# Altium schematic sheet KT603DEMO.SchDoc
size A4
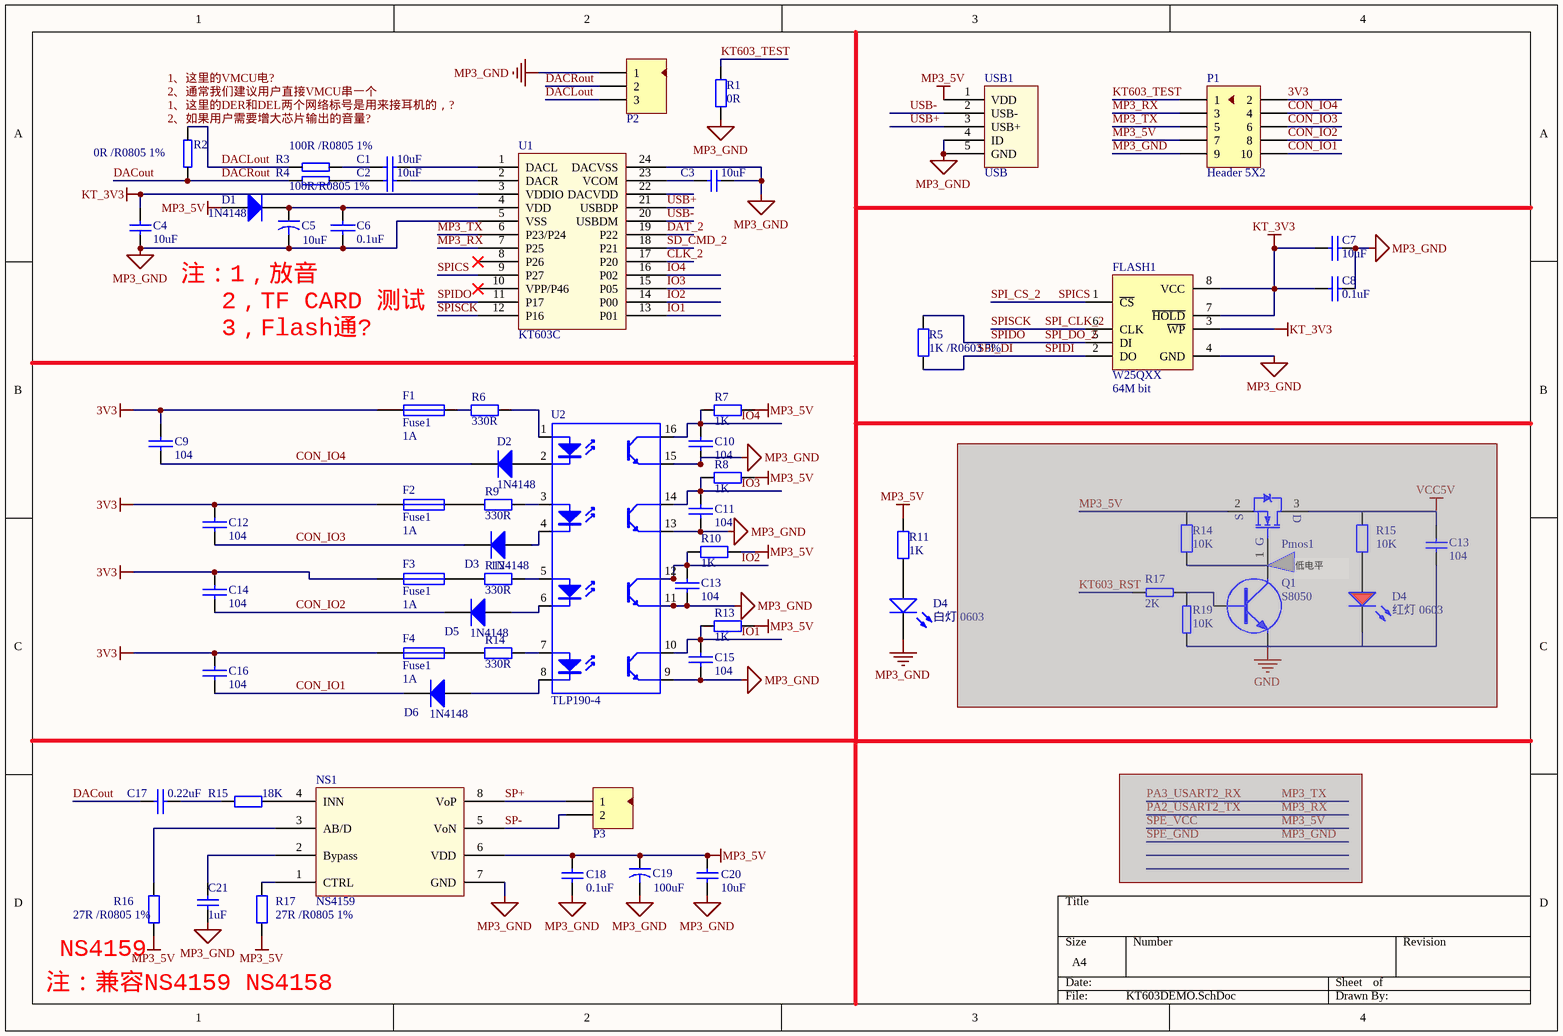
[diagram p0: KT603DEMO.SchDoc]

## Parts
(Parts that share a designator on the sheet are numbered #1, #2 ... from top to bottom, then left to right.)
C1  10uF  [LC-0603_C]
C2  10uF  [LC-0603_C]
C3  10uF  [LC-0805_C]
C4  10uF  [LC-0603_C]
C5  10uF  [LC-0603_C]
C6  0.1uF  [LC-0603_C]
C7  10uF  [LC-0603_C]
C8  0.1uF  [LC-0603_C]
C9  104  [LC-0603_C]
C10  104  [LC-0603_C]
C11  104  [LC-0603_C]
C12  104  [LC-0603_C]
C13#1  104  [LC-0603_C]  (masked out: inside a compile mask, not in the netlist)
C13#2  104  [LC-0603_C]
C14  104  [LC-0603_C]
C15  104  [LC-0603_C]
C16  104  [LC-0603_C]
C17  0.22uF  [LC-0805_C]
C18  0.1uF  [LC-0603_C]
C19  value 100uF  [CAP-3528]  (hidden comment: 220uF/16V)
C20  10uF  [LC-0805_C]
C21  1uF  [LC-0603_C]
D1  1N4148  [1N4148]
D2  1N4148  [LC-SOD-323]
D3  1N4148  [LC-SOD-323]
D4#1  红灯 0603  [LC-0603_LED_S1]  (masked out: inside a compile mask, not in the netlist)
D4#2  白灯 0603  [LC-0603_LED_S1]
D5  1N4148  [LC-SOD-323]
D6  1N4148  [LC-SOD-323]
F1  Fuse1  value 1A  [0805-1]
F2  Fuse1  value 1A  [0805-1]
F3  Fuse1  value 1A  [0805-1]
F4  Fuse1  value 1A  [0805-1]
FLASH1  W25QXX  Memory: 64M bit  [SOIC-8W]
NS1  NS4159  [SOIC8]
P1  Header 5X2  [HDR5X2-2.54]
P2  Header 3  [HDR3X1-2.54]  (value not drawn)
P3  Header 2  [KF2.54-2P]  (value not drawn)
Pmos1  SI2301  [LC-SOT-23(SOT-23-3)]  (value not drawn)  (masked out: inside a compile mask, not in the netlist)
Q1  S8050  [LC-SOT-23(SOT-23-3)]  (masked out: inside a compile mask, not in the netlist)
R1  0R  [R0603]
R2  0R /R0805 1%  [LC-0603_R]
R3  100R /R0805 1%  [LC-0603_R]
R4  100R/R0805 1%  [LC-0603_R]
R5  1K /R0603 5%  [0603-1]
R6  330R  [R0603]
R7  1K  [R0603]
R8  1K  [R0603]
R9  330R  [R0603]
R10  1K  [R0603]
R11  1K  [0603-1]
R12  330R  [R0603]
R13  1K  [R0603]
R14#1  10K  [LC-0603_R]  (masked out: inside a compile mask, not in the netlist)
R14#2  330R  [R0603]
R15#1  10K  [LC-0603_R]  (masked out: inside a compile mask, not in the netlist)
R15#2  18K  [LC-0603_R]
R16  27R /R0805 1%  [LC-0603_R]
R17#1  2K  [LC-0603_R]  (masked out: inside a compile mask, not in the netlist)
R17#2  27R /R0805 1%  [LC-0603_R]
R19  10K  [LC-0603_R]  (masked out: inside a compile mask, not in the netlist)
U1  KT603C  [SSOP24]
U2  TLP190-4  [SO16]
USB1  USB  [USB-MK5]

## Nets
3V3: C9.2 C12.2 C14.2 C16.2 F1.1 F2.1 F3.1 F4.1 P1.2
KT_3V3: C4.2 C7.1 C8.1 FLASH1.3(~{WP}) FLASH1.7(~{HOLD}) FLASH1.8(VCC) U1.3(VDDIO)
MP3_5V: C18.1 C19.1 C20.1 D1.1(A) NS1.6(VDD) P1.7 R7.1 R8.1 R10.1 R11.2 R13.1 R16.2 R17#2.2 USB1.1(VDD)
MP3_GND: C3.2 C4.1 C5.2 C6.1 C7.2 C8.2 C10.1 C11.1 C13#2.1 C15.1 C18.2 C19.2 C20.2 C21.2 D4#2.K FLASH1.4(GND) NS1.7(GND) P1.9 P2.1 R1.2 U1.5(VSS) U1.24(DACVSS) U2.9(E) U2.11(E) U2.13(E) U2.15(E) USB1.4(ID) USB1.5(GND)
CLK_2: U1.17(P20)
CON_IO1: C16.1 D6.2(K) P1.10
CON_IO2: C14.1 D5.2(K) P1.8
CON_IO3: C12.1 D3.2(K) P1.6
CON_IO4: C9.1 D2.2(K) P1.4
DACLout: P2.3 R2.1 R3.2
DACout: C17.1 P2.2 R2.2 R4.2  [also labelled DACRout]
DAT_2: U1.19(P22)
IO1: C15.2 R13.2 U1.13(P01) U2.10(C)
IO2: C13#2.2 R10.2 U1.14(P00) U2.12(C)
IO3: C11.2 R8.2 U1.15(P05) U2.14(C)
IO4: C10.2 R7.2 U1.16(P02) U2.16(C)
KT603_TEST: P1.1 R1.1
MP3_RX: P1.3 U1.7(P25)
MP3_TX: P1.5 U1.6(P23/P24)
SD_CMD_2: U1.18(P21)
SP+: NS1.8(VoP) P3.1
SP-: NS1.5(VoN) P3.2
SPI_CLK_2: FLASH1.6(CLK) U1.12(P16)  [also labelled SPISCK]
SPI_CS_2: FLASH1.1(~{CS}) U1.9(P27)  [also labelled SPICS]
SPI_DI: FLASH1.2(DO) R5.1  [also labelled SPIDI]
SPI_DO_2: FLASH1.5(DI) R5.2 U1.11(P17)  [also labelled SPIDO]
USB+: U1.21(USBDP) USB1.3(USB+)
USB-: U1.20(USBDM) USB1.2(USB-)
NetC1_1: C1.1 R3.1
NetC1_2: C1.2 U1.1(DACL)
NetC2_1: C2.1 R4.1
NetC2_2: C2.2 U1.2(DACR)
NetC3_1: C3.1 U1.23(VCOM)
NetC5_1: C5.1 C6.2 D1.2(K) U1.4(VDD)
NetC17_2: C17.2 R15#2.2
NetC21_1: C21.1 NS1.2(Bypass)
NetD2_1: D2.1(A) U2.2(K)
NetD3_1: D3.1(A) U2.4(K)
NetD4#2_A: D4#2.A R11.1
NetD5_1: D5.1(A) U2.6(K)
NetD6_1: D6.1(A) U2.8(K)
NetF1_2: F1.2 R6.2
NetF2_2: F2.2 R9.2
NetF3_2: F3.2 R12.2
NetF4_2: F4.2 R14#2.2
NetNS1_1: NS1.1(CTRL) R17#2.1
NetNS1_3: NS1.3(AB/D) R16.1
NetNS1_4: NS1.4(INN) R15#2.1
NetR6_1: R6.1 U2.1(A)
NetR9_1: R9.1 U2.3(A)
NetR12_1: R12.1 U2.5(A)
NetR14#2_1: R14#2.1 U2.7(A)

Not connected (* = marked no-connect by the designer): U1 8(P26)* 10(VPP/P46)* 22(DACVDD)

## Notes on the sheet
- 注：1，放音
- 2，TF CARD 测试
- 3，Flash通?
- 低电平
- (near R16) NS4159
- 注：兼容NS4159 NS4158
- Labels drawn without touching a wire or pin: 1、这里的DER和DEL两个网络标号是用来接耳机的，?, 1、这里的VMCU电?, 2、如果用户需要增大芯片输出的音量?, 2、通常我们建议用户直接VMCU串一个

## Library data of the parts
C1 C2 C4 C13#1 C18 C20 C21 = Cap: Capacitor; Published: 8-Jun-2000; Publisher: Altium Limited
  C1 C2 C4 C20: Revision: July-2002: Re-released for DXP Platform.; Value: 10uF
  C13#1: LatestRevisionDate: 17-Jul-2002; LatestRevisionNote: Re-released for DXP Platform.; PackageReference: RAD-0.3; Value: 104
  C18: Revision: July-2002: Re-released for DXP Platform.; Value: 0.1uF
  C21: Revision: July-2002: Re-released for DXP Platform.; Value: 1uF
C3 = Cap: Capacitor; Value: 1uF; Published: 8-Jun-2000; Revision: July-2002: Re-released for DXP Platform.; Publisher: Altium Limited
C5 C19 = Cap2: Capacitor; Published: 23-Sep-2002; PackageReference: CAPR5-4X5; Publisher: Altium Limited
  C5: Value: 10uF
C6-C12 C13#2 C14-C17 = C
D1-D3 D5 D6 = Diode: Default Diode; Published: 8-Jun-2000; LatestRevisionDate: 17-Jul-2002; LatestRevisionNote: Re-released for DXP Platform.; PackageDocument: Sep-1996; PackageReference: SMC; Publisher: Altium Limited; Code_JEDEC: DO-214-AB
D4#1 = 0603 红灯: 发光二极管; ComponentLink1Description: 供应商链接; ComponentLink1URL: http://www.szlcsc.com/product/details_2659.html; Package: 0603; Supplier: LC; SuppliersPartNumber: C2286
D4#2 = 0603 白灯: 发光二极管; ComponentLink1Description: 供应商链接; ComponentLink1URL: http://www.szlcsc.com/product/details_2663.html; Package: 0603; Supplier: LC; SuppliersPartNumber: C2290
F1-F4 = Fuse1: 保险丝
FLASH1 = W25QXX: SPI FLASH
P1 = Header 5X2: 接插件; LatestRevisionDate: 17-Jul-2002; LatestRevisionNote: Re-released for DXP Platform.; Publisher: Altium Limited
P2 = Header 3: 接插件; LatestRevisionDate: 17-Jul-2002; LatestRevisionNote: Re-released for DXP Platform.; Publisher: Altium Limited
P3 = Header: 接插件; LatestRevisionDate: 17-Jul-2002; LatestRevisionNote: Re-released for DXP Platform.; Publisher: Altium Limited
Pmos1 = N-MO
Q1 = NPN
R1 R6-R10 R12 R13 R14#2 = Res2: Resistor; Value: 82R; Published: 8-Jun-2000; LatestRevisionDate: 17-Jul-2002; LatestRevisionNote: Re-released for DXP Platform.; PackageReference: AXIAL-0.4; Publisher: Altium Limited
R2-R4 = RES2
R5 R11 R14#1 R15#2 R16 R17#2 = Res2: Resistor; Published: 8-Jun-2000; LatestRevisionDate: 17-Jul-2002; LatestRevisionNote: Re-released for DXP Platform.; PackageReference: AXIAL-0.4; Publisher: Altium Limited
  R5 R11: Value: 1K
  R14#1: Value: 10K
  R15#2: Value: 18K
  R16 R17#2: Value: 27R
R15#1 = Res2: Resistor; Value: 1K; Published: 8-Jun-2000; LatestRevisionDate: 17-Jul-2002; LatestRevisionNote: Re-released for DXP Platform.; PackageReference: AXIAL-0.4; Publisher: Altium Limited
R17#1 R19 = RES
U1 = AC24-TTS
U2 = TLP290-4